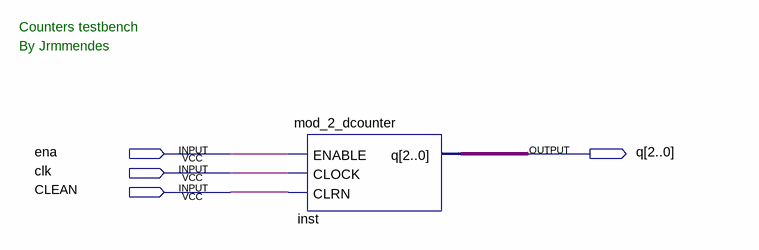
[diagram p0: schematic sheet]
// Quartus schematic counters_tb.bdf as structural Verilog: 1 symbols, 4 pins
module counters_tb (
  input  ena,
  input  clk,
  input  CLEAN,
  output [2:0] q
);

  mod_2_dcounter inst (.ENABLE(ena), .CLOCK(clk), .CLRN(CLEAN), .q(q));

  // Notes on the sheet:
  //   Counters testbench
  //   By Jrmmendes
endmodule
